# Altium schematic sheet WireLessPhone.SchDoc: DevBoard107
size 840 x 594 mm; DrawnBy: Podlesniy; DocumentNumber: 001.00.01; SheetTotal: 1; DocumentType: Электрическая принципиальная; Format: A1; ImagePath: Введите номер платы
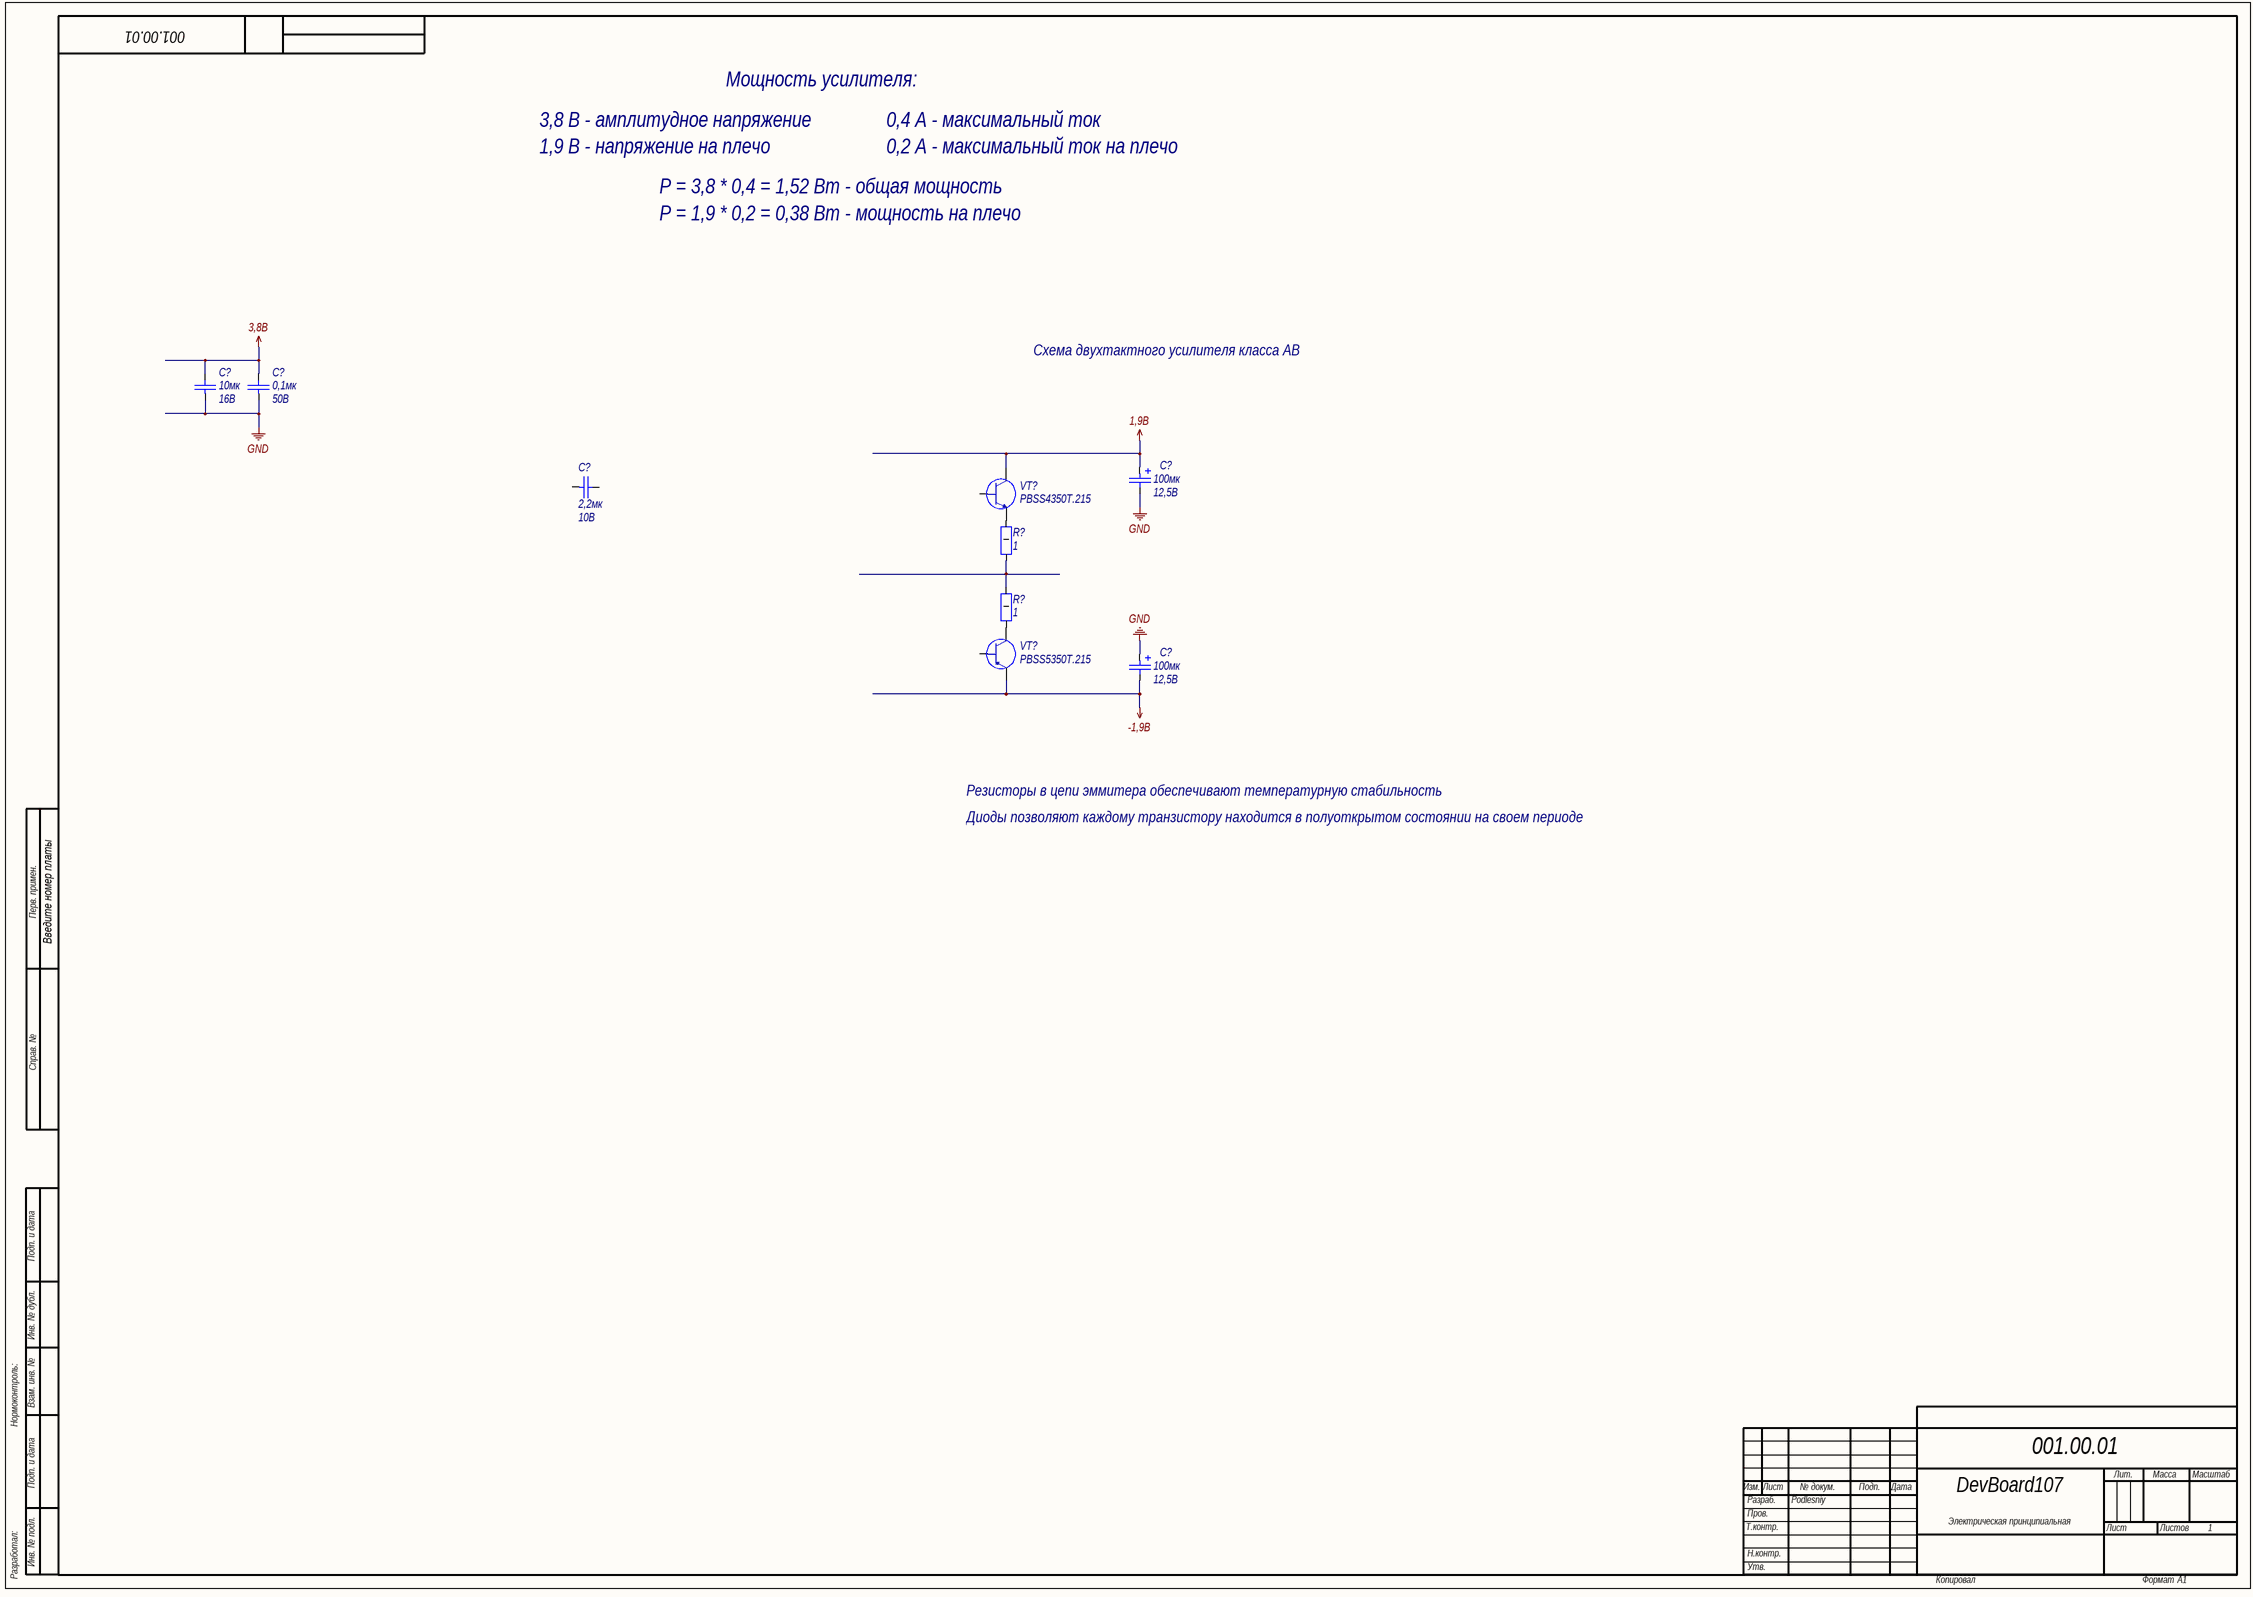
[diagram p0: WireLessPhone.SchDoc]

## Parts
(Parts that share a designator on the sheet are numbered #1, #2 ... from top to bottom, then left to right.)
C?#1  value 10мк  Voltage: 16В  [C1206]  (hidden comment: Capacitor)
C?#2  value 0,1мк  Voltage: 50В  [C0805]  (hidden comment: Capacitor)
C?#3  value 100мк  Voltage: 12,5В  [TANTAL CASE E]  (hidden comment: Capacitor_pol)
C?#4  value 2,2мк  Voltage: 10B  [C0603]  (hidden comment: Capacitor)
C?#5  value 100мк  Voltage: 12,5В  [TANTAL CASE E]  (hidden comment: Capacitor_pol)
R?#1  value 1  [R2512]  (hidden comment: Resistor_1Вт)
R?#2  value 1  [R2512]  (hidden comment: Resistor_1Вт)
VT?#1  Part Number: PBSS4350T.215  [SOT23-3]  (hidden comment: BJT NPN)
VT?#2  Part Number: PBSS5350T.215  [SOT23-3]  (hidden comment: BJT PNP)

## Nets
1,9В: C?#3.1 VT?#1.3
3,8В: C?#1.2 C?#2.2
-1,9В: C?#5.2 VT?#2.2
GND: C?#1.1 C?#2.1 C?#3.2 C?#5.1
NetR?#1_1: R?#1.1 R?#2.2
NetR?#1_2: R?#1.2 VT?#1.2
NetR?#2_1: R?#2.1 VT?#2.3

Not connected (* = marked no-connect by the designer): C?#4 1 2; VT?#1 1; VT?#2 1

## Notes on the sheet
- Мощность усилителя:
- 3,8 В - амплитудное напряжение
- 0,4 А - максимальный ток
- 1,9 В - напряжение на плечо
- 0,2 А - максимальный ток на плечо
- Р = 3,8 * 0,4 = 1,52 Вт - общая мощность
- Р = 1,9 * 0,2 = 0,38 Вт - мощность на плечо
- Схема двухтактного усилителя класса АВ
- Резисторы в цепи эммитера обеспечивают температурную стабильность
- Диоды позволяют каждому транзистору находится в полуоткрытом состоянии на своем периоде
- Перв. примен.
- Справ. №
- Подп. и дата
- Инв. № дубл.
- Нормоконтроль:
- Взам. инв. №
- Изм.
- Лист
- № докум.
- Подп.
- Дата
- Лит.
- Масса
- Масштаб
- Т.контр.
- Пров.
- Разраб.
- Листов
- Разработал:
- Инв. № подл.
- Н.контр.
- Утв.
- Копировал
- Формат

## Library data of the parts
C?#1 = cap191: Конденсатор; Part Name: Ceramic; Manufacture: Murata; Part Number: GRM31CR71C106K*; id: cap191; TKE: X7R
C?#2 = cap161: Конденсатор; Part Name: Ceramic; Manufacture: Murata; Part Number: GRM21BR71H104KA01L; id: cap161; TKE: X7R
C?#3 C?#5 = cap197: Конденсатор полярный; Part Name: Polimer; Manufacture: Murata; Part Number: ECASD91B107M012K00; id: cap197; TKE: 12mOhm
C?#4 = cap135: Конденсатор; Part Name: Ceramic; Manufacture: Murata; Part Number: GRM188R71A225KE15D; id: cap135; TKE: X7R
R?#1 R?#2 = res773: Резистор; Manufacture: Yageo; Part Number: RC2512FR-071RL; id: res773; Accuracy: 1%; Power: 1Вт; Part Name: Resistor
VT?#1 = bjt5: Part Name: Transistor; id: bjt5; hfe: 300; Vceo max: 50В; Ic max: 2А; Power: 0,48Вт; Frequency: 100МГц; Structure: npn
VT?#2 = bjt6: Part Name: Transistor; id: bjt6; hfe: 300; Vceo max: 50В; Ic max: 2А; Power: 0,48Вт; Frequency: 100МГц; Structure: pnp